# EAGLE design atxmega16d4simple (EAGLE 7.3.0)
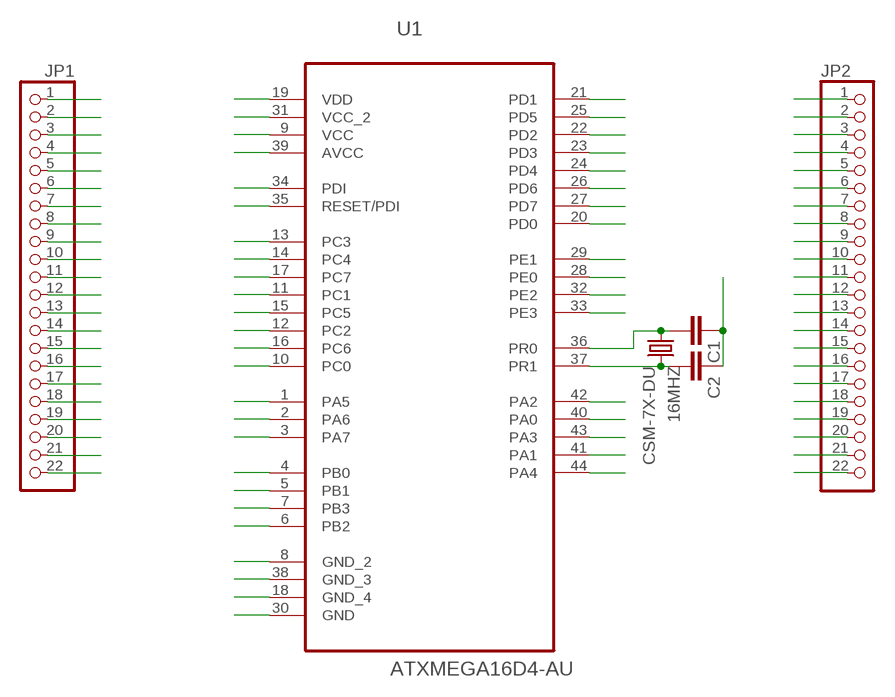
[diagram p0: schematic, sheet 1]

## Parts
16MHZ  CSM-7X-DU  [CSM-7X-DU]
C1  C-EUC0805K  [C0805K]
C2  C-EUC0805K  [C0805K]
JP1  PINHD-1X22  [1X22]
JP2  PINHD-1X22  [1X22]
U1  ATXMEGA16D4-AU  [QFP80P1200X1200X120-44N]

## Nets
3.3V: JP1.9 JP1.19 JP2.9 U1.9(VCC) U1.19(VDD) U1.31(VCC_2)
AVCC: JP2.17 U1.39(AVCC)
GND: C1.1 C2.1 JP1.8 JP1.18 JP2.8 JP2.16 U1.8(GND_2) U1.18(GND_4) U1.30(GND) U1.38(GND_3)
PA0: JP2.18 U1.40(PA0)
PA1: JP2.19 U1.41(PA1)
PA2: JP2.20 U1.42(PA2)
PA3: JP2.21 U1.43(PA3)
PA4: JP2.22 U1.44(PA4)
PA5: JP1.1 U1.1(PA5)
PA6: JP1.2 U1.2(PA6)
PA7: JP1.3 U1.3(PA7)
PB0: JP1.4 U1.4(PB0)
PB1: JP1.5 U1.5(PB1)
PB2: JP1.6 U1.6(PB2)
PB3: JP1.7 U1.7(PB3)
PC0: JP1.10 U1.10(PC0)
PC1: JP1.11 U1.11(PC1)
PC2: JP1.12 U1.12(PC2)
PC3: JP1.13 U1.13(PC3)
PC4: JP1.14 U1.14(PC4)
PC5: JP1.15 U1.15(PC5)
PC6: JP1.16 U1.16(PC6)
PC7: JP1.17 U1.17(PC7)
PD0: JP1.20 U1.20(PD0)
PD1: JP1.21 U1.21(PD1)
PD2: JP1.22 U1.22(PD2)
PD3: JP2.1 U1.23(PD3)
PD4: JP2.2 U1.24(PD4)
PD5: JP2.3 U1.25(PD5)
PD6: JP2.4 U1.26(PD6)
PD7: JP2.5 U1.27(PD7)
PDI: JP2.12 U1.34(PDI)
PE0: JP2.6 U1.28(PE0)
PE1: JP2.7 U1.29(PE1)
PE2: JP2.10 U1.32(PE2)
PE3: JP2.11 U1.33(PE3)
PR0: 16MHZ.1 C1.2 JP2.14 U1.36(PR0)
PR1: 16MHZ.2 C2.2 JP2.15 U1.37(PR1)
RESET: JP2.13 U1.35(RESET/PDI)

## Library data of the parts
16MHZ = quarz:CSM-7X-DU: SMD CRYSTAL Source: www.ecsxtal.com .. Crystal 3.6864MHz CSM_7X_DU.PDF; OC_FARNELL: unknown; OC_NEWARK: unknown
C1 C2 = rcl:C-EU: CAPACITOR, European symbol
JP1 JP2 = pinhead:PINHD-1X22: PIN HEADER
U1 = atxmega16d4au:ATXMEGA16D4-AU: 8/16-bit Atmel XMEGA D4 Microcontroller; MPN: ATXMEGA16D4-AU; OC_FARNELL: 1748553; OC_NEWARK: 68T3906; PACKAGE: TQFP-44; SUPPLIER: ATMEL

## Net classes
0 default: width 0.406 mm, drill 0.406 mm, clearance 0.406 mm

## Board
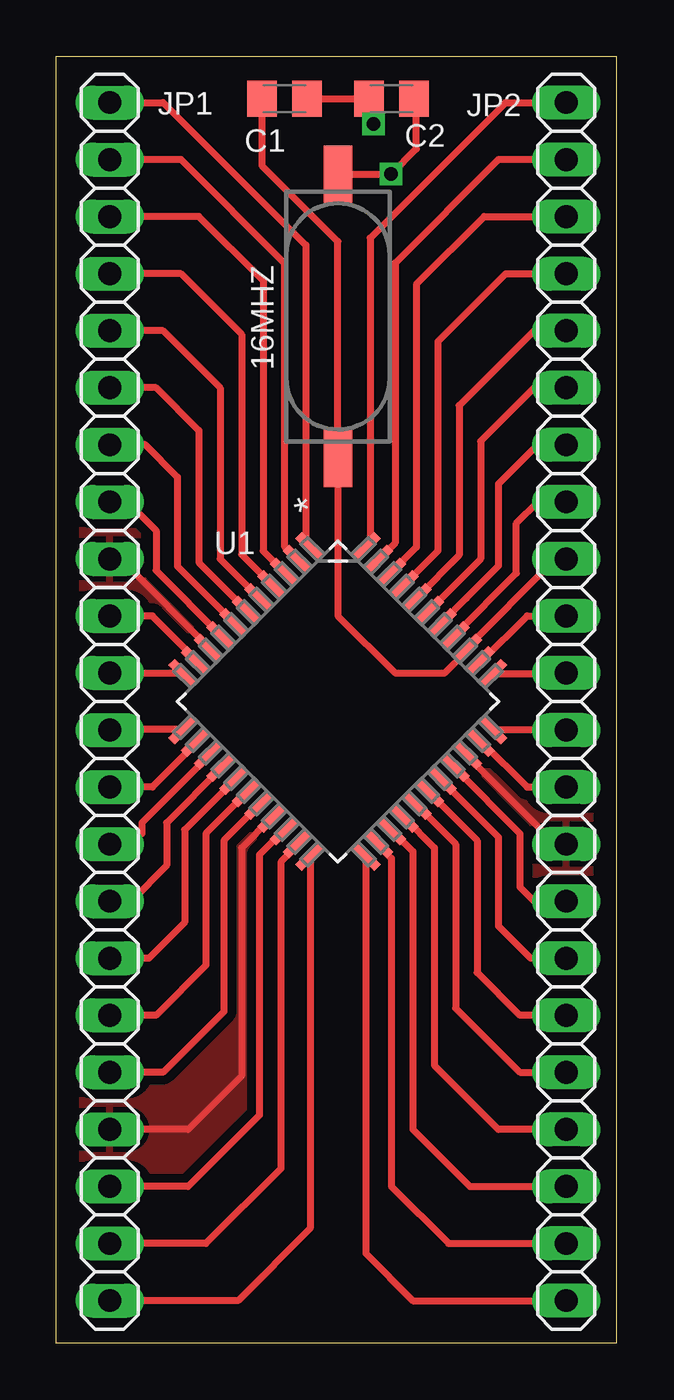
[diagram p1: board, top side]
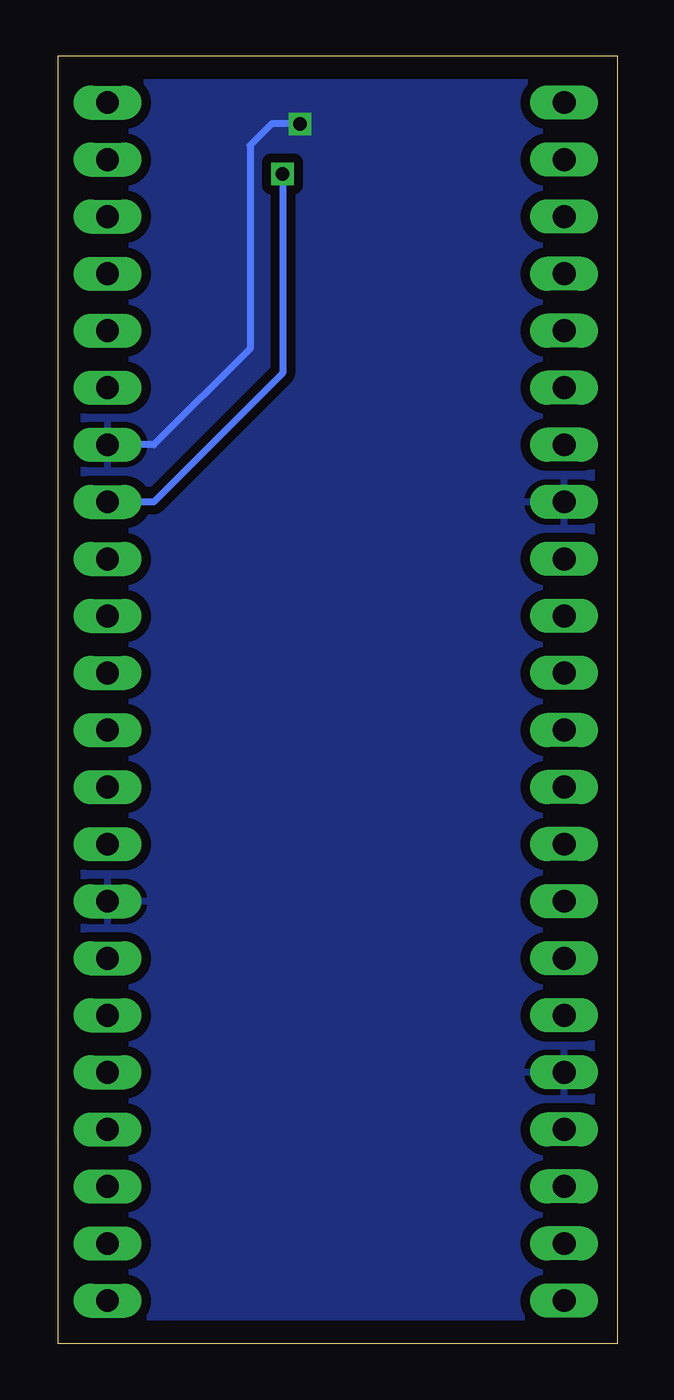
[diagram p2: board, bottom side, seen from below]

Size 24.92 x 57.31 mm. Coordinates in mm from the lower left corner, seen from the top.
Outline: 0,57.31 24.92,57.31 24.92,0 0,0 0,57.31
Copper layers (1*16): Top 0.035mm / dielectric 1.5mm / Bottom 0.035mm
Design rules "default": minimum track width 10mil, minimum drill 24mil, track to track 8mil, track to pad 8mil, pad to pad 8mil, via to via 8mil, smd to smd 8mil, copper to edge 40mil, drill to drill 8mil, minimum pad ring 10mil, minimum via ring 8mil, stop-mask expansion 4mil, vias tented up to drill 0mil, thermal gap 10mil

### Footprints (pad centres in the part's own frame; a part is rotated, then mirrored left to right if it is on the bottom)
CSM-7X-DU = smd 2.54 x 1.27: 1 -6.338,0; 2 6.338,0
C0805K = smd 1.3 x 1.6: 1 -1,0; 2 1,0
1X22 = drill 1.016 long: 1 -26.67,0; 2 -24.13,0; 3 -21.59,0; 4 -19.05,0; 5 -16.51,0; 6 -13.97,0; 7 -11.43,0; 8 -8.89,0; 9 -6.35,0; 10 -3.81,0; 11 -1.27,0; 12 1.27,0; 13 3.81,0; 14 6.35,0; 15 8.89,0; 16 11.43,0; 17 13.97,0; 18 16.51,0; 19 19.05,0; 20 21.59,0; 21 24.13,0; 22 26.67,0
QFP80P1200X1200X120-44N = smd 1.473 x 0.406: 1 -5.74,3.988; 2 -5.74,3.2; 3 -5.74,2.388; 4 -5.74,1.6; 5 -5.74,0.787; 6 -5.74,0; 7 -5.74,-0.787; 8 -5.74,-1.6; 9 -5.74,-2.388; 10 -5.74,-3.2; 11 -5.74,-3.988; 23 5.74,-3.988; 24 5.74,-3.2; 25 5.74,-2.388; 26 5.74,-1.6; 27 5.74,-0.787; 28 5.74,0; 29 5.74,0.787; 30 5.74,1.6; 31 5.74,2.388; 32 5.74,3.2; 33 5.74,3.988 | smd 0.406 x 1.473: 12 -3.988,-5.74; 13 -3.2,-5.74; 14 -2.388,-5.74; 15 -1.6,-5.74; 16 -0.787,-5.74; 17 0,-5.74; 18 0.787,-5.74; 19 1.6,-5.74; 20 2.388,-5.74; 21 3.2,-5.74; 22 3.988,-5.74; 34 3.988,5.74; 35 3.2,5.74; 36 2.388,5.74; 37 1.6,5.74; 38 0.787,5.74; 39 0,5.74; 40 -0.787,5.74; 41 -1.6,5.74; 42 -2.388,5.74; 43 -3.2,5.74; 44 -3.988,5.74

### Placement (x,y rotation side)
16MHZ  12.54,45.72 90 top
C1  10.16,55.4 180 top
C2  14.92,55.4 0 top
JP1  2.38,28.57 270 top
JP2  22.7,28.57 90 top
U1  12.54,28.57 315 top

### Tracks (layer width: path | path; a pad name or v marks a point on that pad's centre or on a via)
3.3V
  Top 0.305: U1.9 6.79,30.99 3.17,34.61 3.17,34.77 3.02,34.92 JP1.9 | U1.31 18.29,26.16 22.07,22.38 22.54,22.38 JP2.9 | U1.19 9.57,23.38 8.26,22.07 8.26,11.91 5.87,9.53 JP1.19
  pour Top: 0.16,0.16 24.77,0.16 24.77,57.15 0.16,57.15
3.3V1
  Top 0.305: 18.29,26.2 18.29,26.16
AVCC
  Top 0.305: JP2.17 21.27,42.55 18.89,40.16 18.89,34.92 U1.39
GND  (via drill 0.6 pad 0.3)
  Top 0.305: U1.8 4.45,34.41 4.45,36.2 3.17,37.47 JP1.8 | U1.30 17.73,25.61 20.64,22.7 20.64,20.32 21.27,19.68 JP2.8 | U1.18 7.46,22.38 7.46,14.76 4.76,12.06 JP1.18 | JP2.16 21.43,40.01 19.68,38.26 19.68,34.61 18.26,33.18 U1.38 | C1.1 C2.1 13.92,54.5 v14.13,54.29
  Bottom 0.305: v14.13,54.29 15.4,54.29 16.35,53.34 16.35,44.29 20.64,40.01 JP2.16
  pour Bottom: 0.16,57.15 24.77,57.15 24.77,0.16 0.16,0.16
PA0
  Top 0.305: JP2.18 21.27,45.09 17.94,41.75 17.94,35.09 U1.40
PA1
  Top 0.305: U1.41 16.99,35.28 16.99,44.61 20,47.62 JP2.19
PA2
  Top 0.305: U1.42 16.03,35.44 16.03,47.15 19.05,50.16 JP2.20
PA3
  Top 0.305: JP2.21 19.68,52.7 15.08,48.1 15.08,35.64 U1.43
PA4
  Top 0.305: U1.44 13.97,35.8 13.97,49.21 20,55.24 JP2.22
PA5
  Top 0.305: U1.1 11.11,35.64 11.11,48.9 4.76,55.24 JP1.1
PA6
  Top 0.305: U1.2 10.16,35.48 10.16,48.1 5.56,52.7 JP1.2
PA7
  Top 0.305: U1.3 9.21,35.28 9.21,47.31 6.35,50.16 JP1.3
PA8
  Top 0.305: 13.97,21.51 13.78,21.7
PA9
  Top 0.305: 14.34,22.25 14.42,22.25
PA10
  Top 0.305: 14.91,22.83 14.96,22.83
PB0
  Top 0.305: U1.4 8.26,35.12 8.26,44.93 5.56,47.62 JP1.4
PB1
  Top 0.305: U1.5 7.3,34.93 7.3,42.55 4.76,45.09 JP1.5
PB2
  Top 0.305: U1.6 6.35,34.77 6.35,40.64 4.45,42.55 JP1.6
PB3
  Top 0.305: U1.7 5.4,34.6 5.4,38.58 3.97,40.01 JP1.7
PB4
  Top 0.305: 15.47,23.38 15.51,23.38
PB5
  Top 0.305: 16.04,23.96 16.05,23.96
PB6
  Top 0.305: 17.16,25.07
PC0
  Top 0.305: U1.10 6.22,30.45 4.29,32.38 JP1.10
PC1
  Top 0.305: U1.11 2.41,29.81 JP1.11
PC2
  Top 0.305: U1.12 2.41,27.34 JP1.12
PC3
  Top 0.305: U1.13 6.22,26.7 4.29,24.77 JP1.13
PC4
  Top 0.305: U1.14 6.79,26.16 3.81,23.18 3.81,22.7 3.33,22.23 JP1.14
PC5
  Top 0.305: U1.15 7.35,25.61 4.92,23.18 4.92,21.27 3.33,19.68 JP1.15
PC6
  Top 0.305: U1.16 5.71,22.86 5.71,18.73 4.13,17.14 JP1.16
PC7
  Top 0.305: U1.17 6.67,22.7 6.67,16.83 4.45,14.61 JP1.17
PC8
  Top 0.305: 18.86,26.78 18.86,26.7
PD0
  Top 0.305: U1.20 10.13,22.83 9.05,21.75 9.05,10.16 5.87,6.99 JP1.20
PD1
  Top 0.305: U1.21 10.74,22.18 10,21.43 10,7.78 6.67,4.45 JP1.21
PD2
  Top 0.305: U1.22 11.3,5.11 8.1,1.91 JP1.22
PD3
  Top 0.305: U1.23 13.78,4 15.88,1.91 JP2.1
PD4
  Top 0.305: U1.24 14.34,22.18 14.92,21.59 14.92,6.99 17.46,4.45 JP2.2
PD5
  Top 0.305: U1.25 14.96,22.83 15.88,21.91 15.88,9.53 18.41,6.99 JP2.3
PD6
  Top 0.305: JP2.4 19.68,9.53 16.83,12.38 16.83,22.07 15.51,23.38 U1.26
PD7
  Top 0.305: U1.27 17.78,22.23 17.78,14.92 20.64,12.06 JP2.5
PDI
  Top 0.305: U1.34 22.67,29.81 JP2.12
PE0
  Top 0.305: JP2.6 20.64,14.61 18.73,16.51 18.73,22.38 U1.28
PE1
  Top 0.305: JP2.7 21.11,17.14 19.68,18.57 19.68,22.54 U1.29
PE2
  Top 0.305: U1.32 18.94,26.78 20.95,24.77 JP2.10
PE3
  Top 0.305: U1.33 22.67,27.34 JP2.11
PR0
  Top 0.305: JP2.14 22.54,34.77 22.07,34.77 18.29,30.99 U1.36 18.29,30.83 17.3,29.84 15.08,29.84 12.54,32.38 16MHZ.1 12.54,49.05 9.16,52.44 C1.2
PR1  (via drill 0.6 pad 0.3)
  Top 0.305: U1.37 17.73,31.54 20.48,34.29 20.48,36.51 21.43,37.47 JP2.15 | 16MHZ.2 v14.91,52.06 16.03,53.18 16.03,55.29 C2.2
  Bottom 0.305: v14.91,52.06 14.91,43.19 20.64,37.47 JP2.15
RESET
  Top 0.305: U1.35 18.94,30.37 20.95,32.38 JP2.13

### Text on the board
_tNames: JP1 | JP1 | JP1 | JP2 | JP2 | JP2 | U1 | U1 | U1